# Altium schematic sheet SmartHelmet.SchDoc
size 610 x 355 mm; SheetNumber: 1; SheetTotal: 1
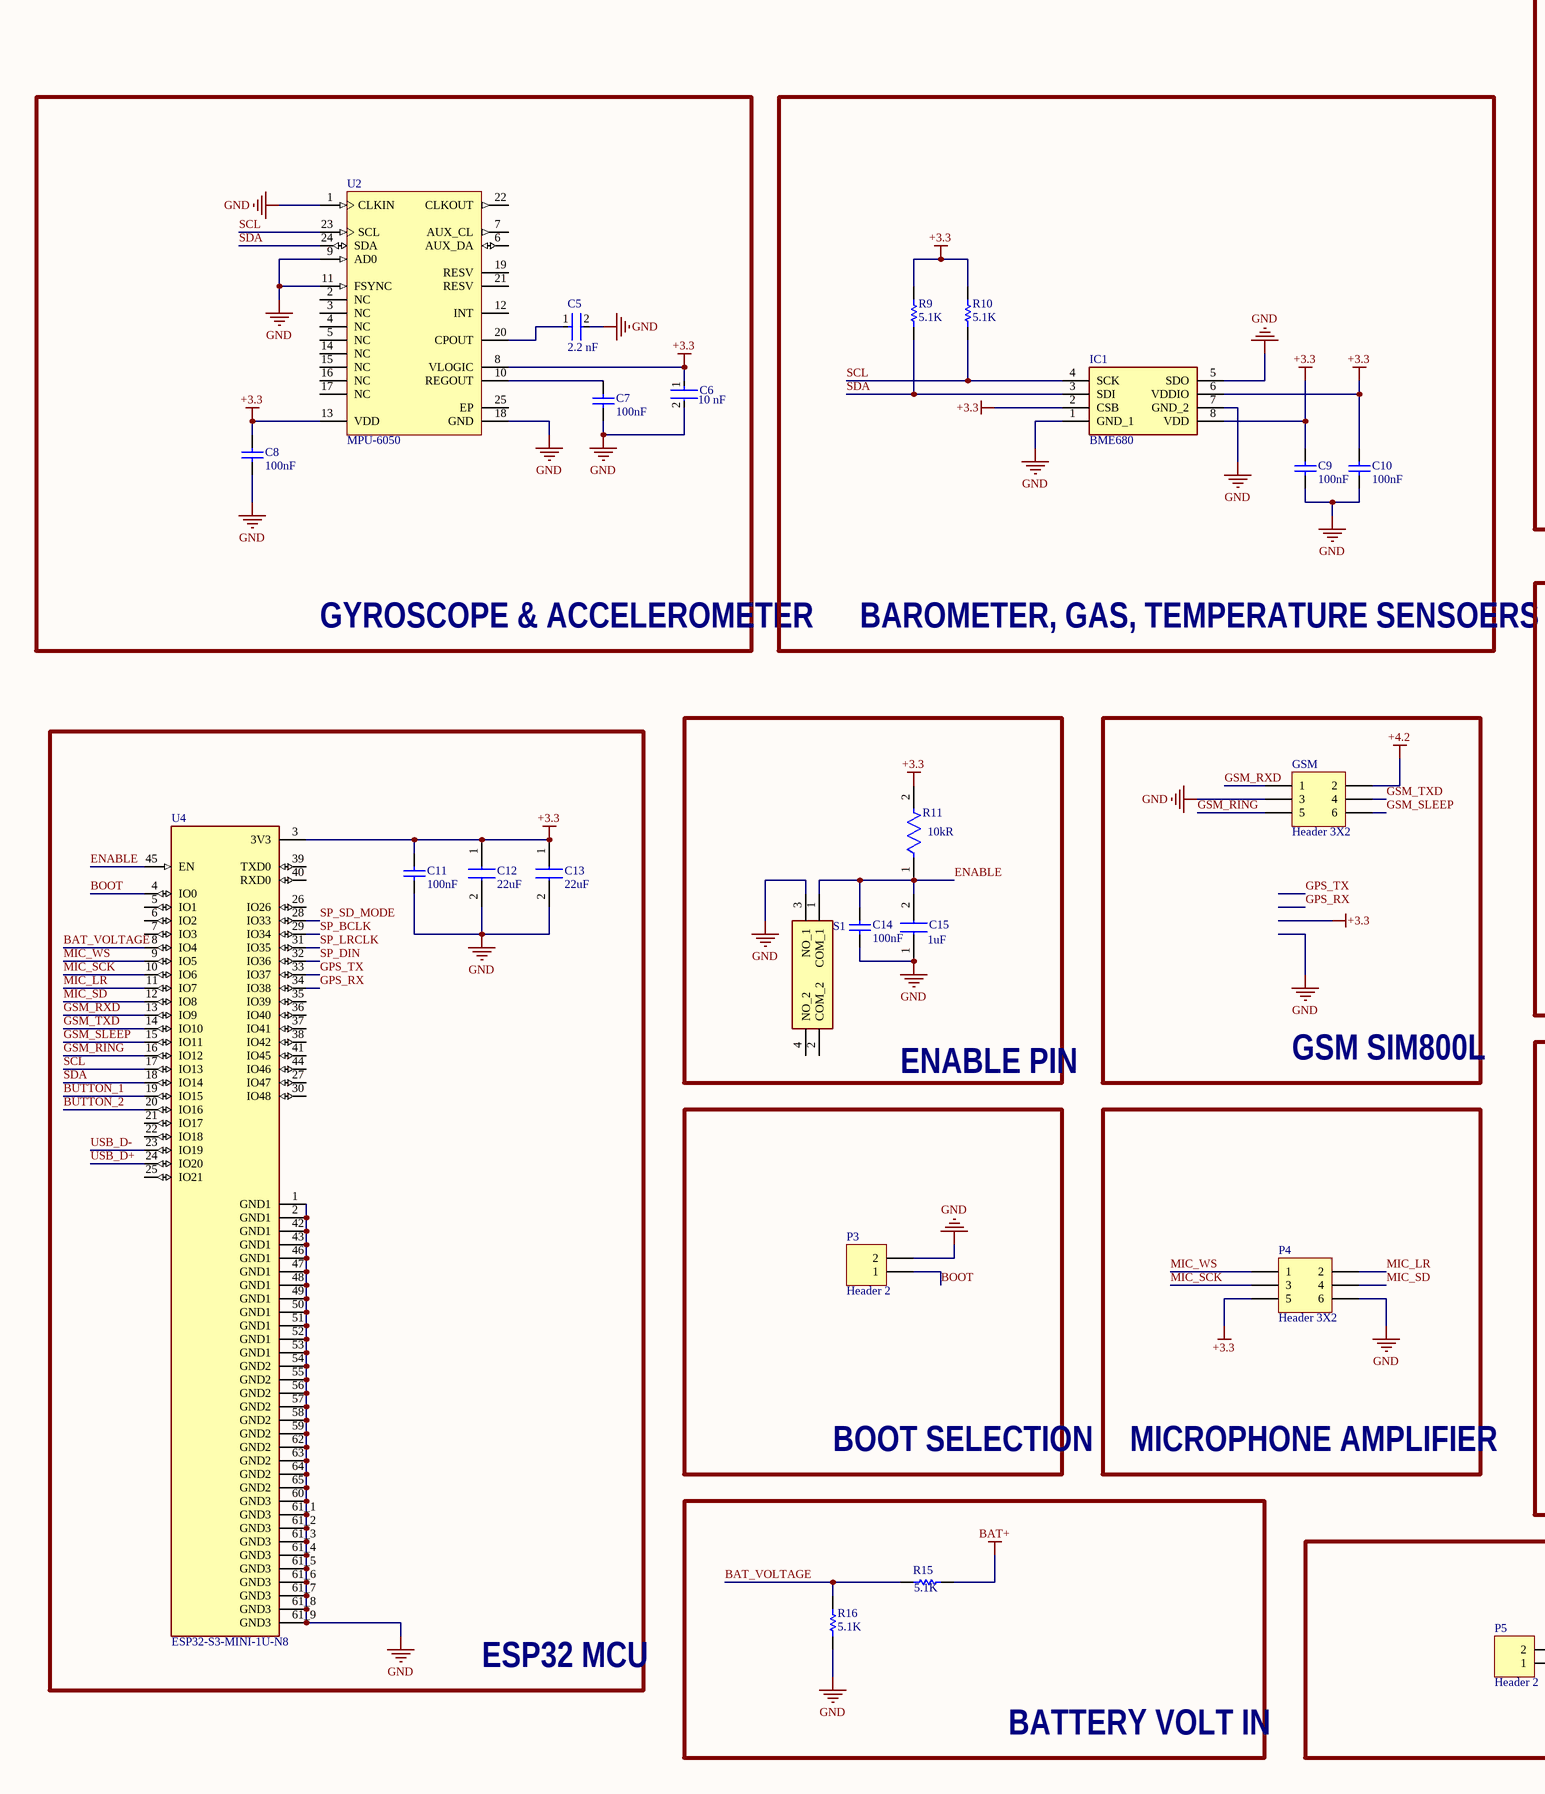
[diagram p0: SmartHelmet.SchDoc, left]
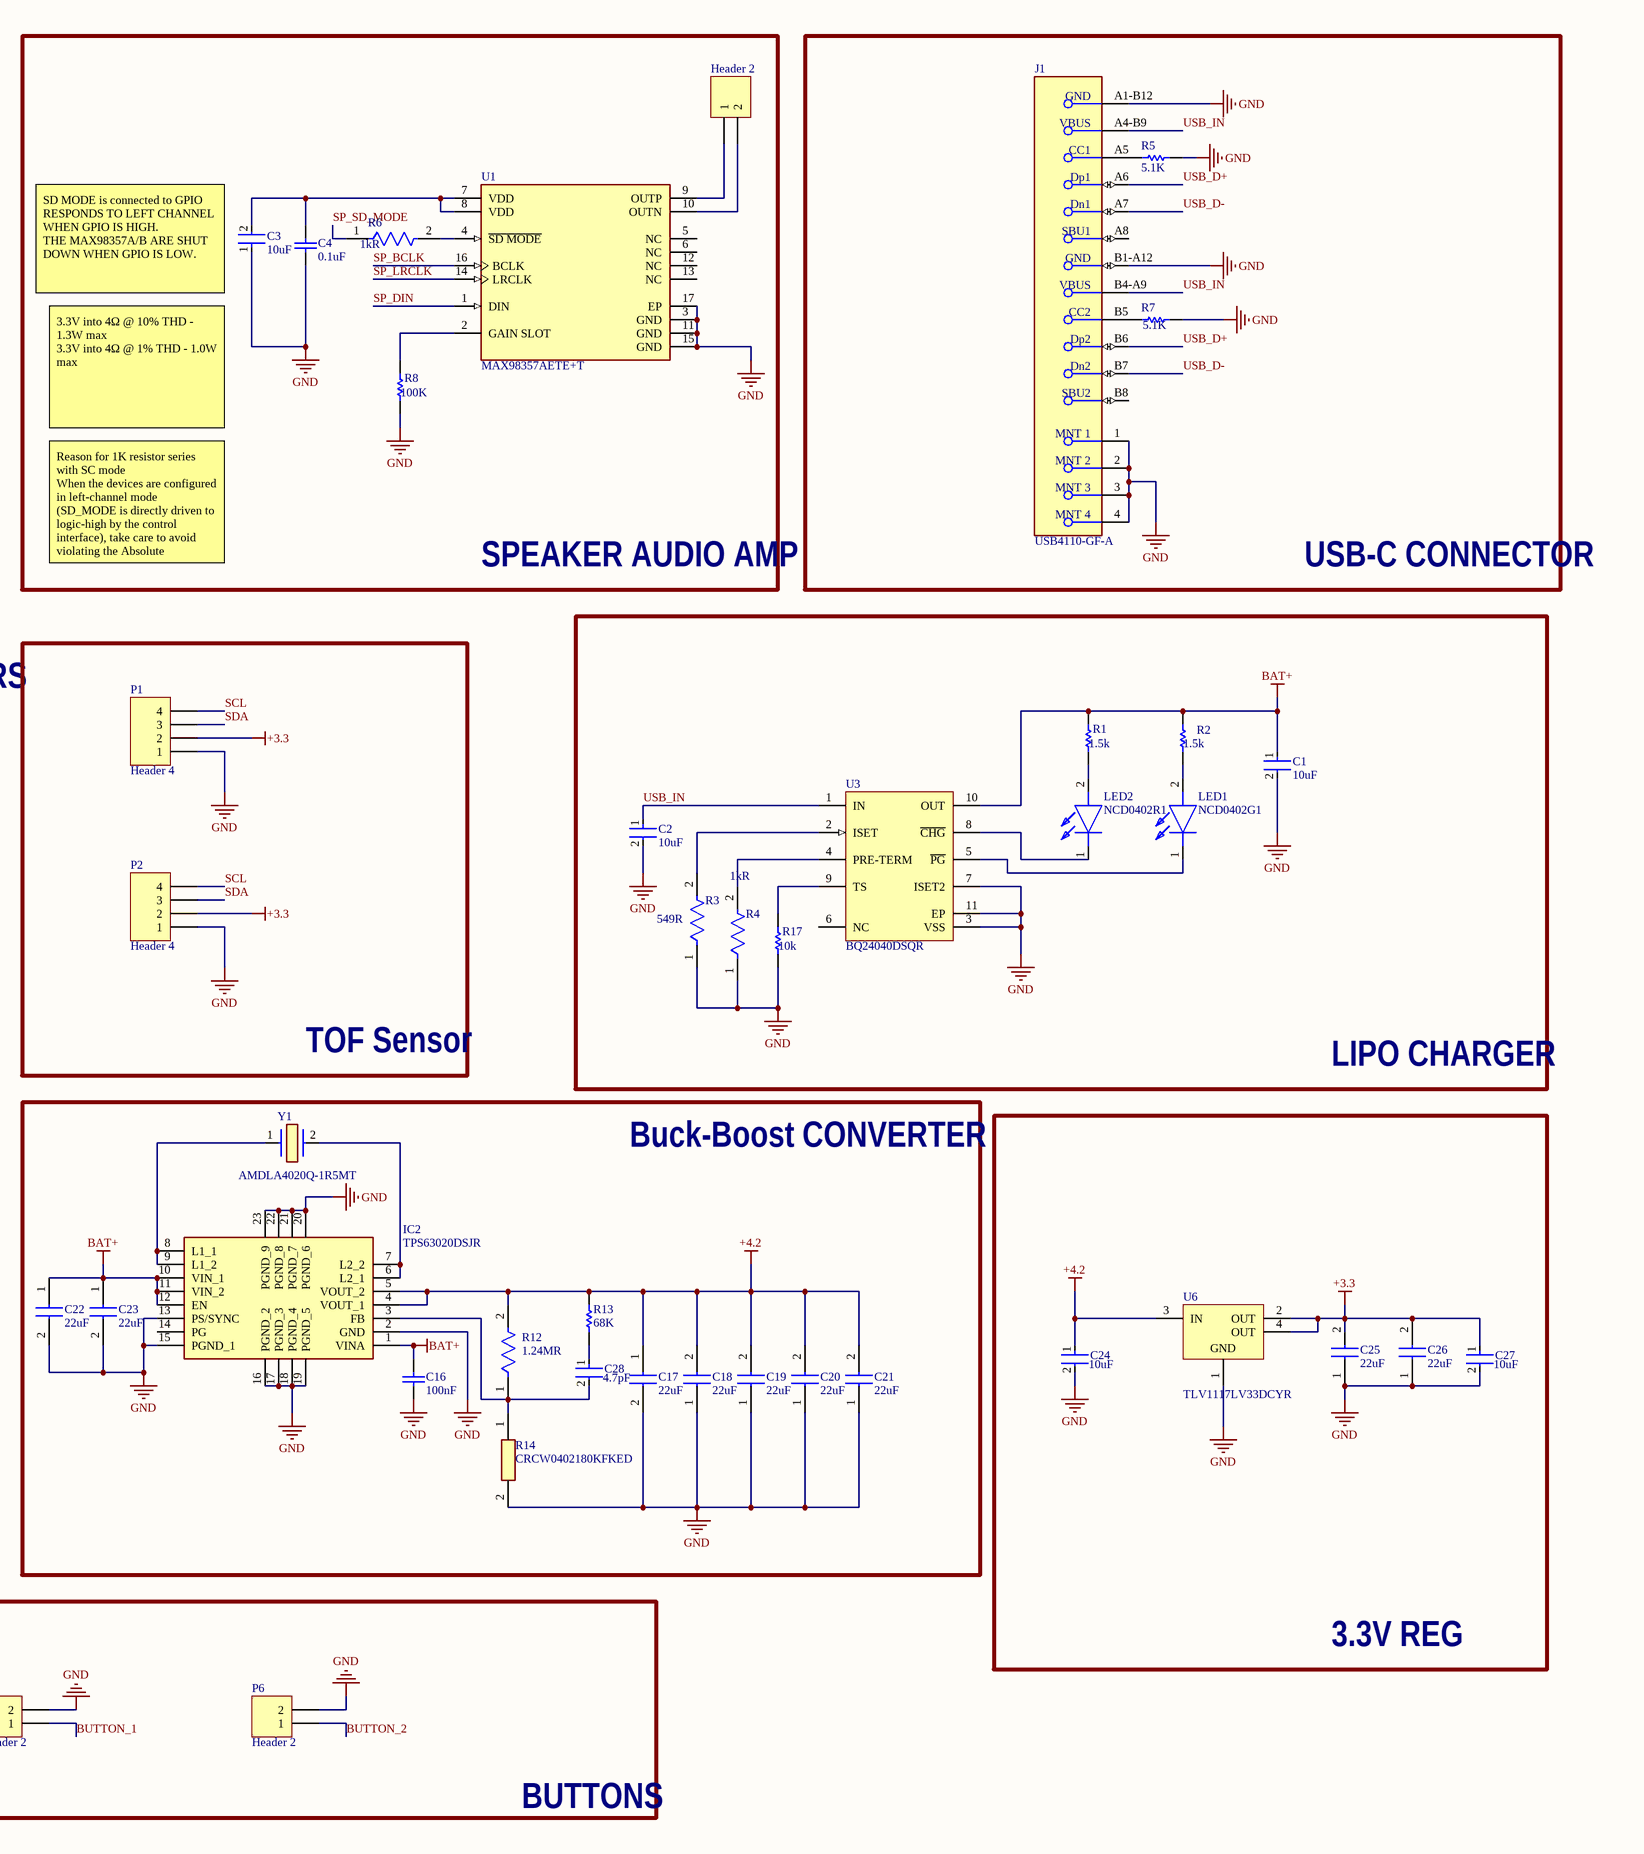
[diagram p1: SmartHelmet.SchDoc, right]

## Parts
C1  Capacitance: 10uF  [FP-CL05A106MP5NUNC-MFG]  (hidden comment: CL05A106MP5NUNC)
C2  Capacitance: 10uF  [FP-CL05A106MP5NUNC-MFG]  (hidden comment: CL05A106MP5NUNC)
C3  Capacitance: 10uF  [FP-CL05A106MP5NUNC-MFG]  (hidden comment: CL05A106MP5NUNC)
C4  Capacitance: 0.1uF  [CAPC1050X55X23ML05T13]  (hidden comment: CL05B104KO5NNNC)
C5  Capacitance: 2.2 nF  [FP-CC0402-MFG]  (hidden comment: CC0402KRX7R9BB222)
C6  Capacitance: 10 nF  [FP-CC0402-MFG]  (hidden comment: CC0402KRX7R9BB103)
C7  Capacitance: 100nF  [CAPC1050X55X23ML05T13]  (hidden comment: CL05B104KO5NNNC)
C8  Capacitance: 100nF  [CAPC1050X55X23ML05T13]  (hidden comment: CL05B104KO5NNNC)
C9  Capacitance: 100nF  [CAPC1050X55X23ML05T13]  (hidden comment: CL05B104KO5NNNC)
C10  Capacitance: 100nF  [CAPC1050X55X23ML05T13]  (hidden comment: CL05B104KO5NNNC)
C11  Capacitance: 100nF  [CAPC1050X55X23ML05T13]  (hidden comment: CL05B104KO5NNNC)
C12  value 22uF  [CAPC1608X105N]  (hidden comment: CL10A226MP8NUNE)
C13  value 22uF  [CAPC1608X105N]  (hidden comment: CL10A226MP8NUNE)
C14  Capacitance: 100nF  [CAPC1050X55X23ML05T13]  (hidden comment: CL05B104KO5NNNC)
C15  Capacitance: 1uF  [CAPC1005X55N]  (hidden comment: GRM155C71C105KE11J)
C16  Capacitance: 100nF  [CAPC1050X55X23ML05T13]  (hidden comment: CL05B104KO5NNNC)
C17  value 22uF  [CAPC1608X105N]  (hidden comment: CL10A226MP8NUNE)
C18  value 22uF  [CAPC1608X105N]  (hidden comment: CL10A226MP8NUNE)
C19  value 22uF  [CAPC1608X105N]  (hidden comment: CL10A226MP8NUNE)
C20  value 22uF  [CAPC1608X105N]  (hidden comment: CL10A226MP8NUNE)
C21  value 22uF  [CAPC1608X105N]  (hidden comment: CL10A226MP8NUNE)
C22  value 22uF  [CAPC1608X105N]  (hidden comment: CL10A226MP8NUNE)
C23  value 22uF  [CAPC1608X105N]  (hidden comment: CL10A226MP8NUNE)
C24  Capacitance: 10uF  [FP-CL05A106MP5NUNC-MFG]  (hidden comment: CL05A106MP5NUNC)
C25  value 22uF  [CAPC1608X105N]  (hidden comment: CL10A226MP8NUNE)
C26  value 22uF  [CAPC1608X105N]  (hidden comment: CL10A226MP8NUNE)
C27  Capacitance: 10uF  [FP-CL05A106MP5NUNC-MFG]  (hidden comment: CL05A106MP5NUNC)
C28  Capacitance: 4.7pF  [FP-GCQ155-0_05-IPC_B]  (hidden comment: GCQ1555C1H4R7BB01D)
GSM  Header 3X2  [HDR2X3]
IC1  BME680  [BME680]
IC2  TPS63020DSJR  [TPS63020DSJR]
J1  USB4110-GF-A  [FP-USB4110-GF-A-MFG]
LED1  NCD0402G1  [NCD0402R1]
LED2  NCD0402R1  [NCD0402R1]
P1  Header 4  [HDR1X4]
P2  Header 4  [HDR1X4]
P3  Header 2  [HDR1X2]
P4  Header 3X2  [HDR2X3]
P5  Header 2  [HDR1X2]
P6  Header 2  [HDR1X2]
P7  Header 2  [HDR1X2]
R1  value 1.5k  [RESC1005X40X25ML05T10]  (hidden comment: RC0402FR-071K5L)
R2  value 1.5k  [RESC1005X40X25ML05T10]  (hidden comment: RC0402FR-071K5L)
R3  Resistance: 549R  [FP-AC0402-IPC_B]  (hidden comment: AC0402FR-07549RL)
R4  Resistance: 1kR  [FP-RC0402-0_4-IPC_A]  (hidden comment: RC0402FR-071KL)
R5  Resistance: 5.1K  [RESC1005X40X25ML10T10]  (hidden comment: RK73H1ETTP5101F)
R6  Resistance: 1kR  [FP-CRCW0402-e3-MFG]  (hidden comment: CRCW04021K00FKED)
R7  Resistance: 5.1K  [RESC1005X40X25ML10T10]  (hidden comment: RK73H1ETTP5101F)
R8  resistance: 100K  [RESC1005X40X25NL05T10]  (hidden comment: RC0402FR-07100KL)
R9  Resistance: 5.1K  [RESC1005X40X25ML10T10]  (hidden comment: RK73H1ETTP5101F)
R10  Resistance: 5.1K  [RESC1005X40X25ML10T10]  (hidden comment: RK73H1ETTP5101F)
R11  Resistance: 10kR  [FP-CRCW0402-e3-IPC_C]  (hidden comment: CRCW040210K0FKEE)
R12  Resistance: 1.24MR  [FP-CRCW0402-e3-IPC_C]  (hidden comment: CRCW04021M24FKED)
R13  Resistance: 68K  [RESC1005X40X25LL05T05]  (hidden comment: CRCW040268K0FKED)
R14  CRCW0402180KFKED  [RESC1005X40N]
R15  Resistance: 5.1K  [RESC1005X40X25ML10T10]  (hidden comment: RK73H1ETTP5101F)
R16  Resistance: 5.1K  [RESC1005X40X25ML10T10]  (hidden comment: RK73H1ETTP5101F)
R17  value 10k  [RESC1005X40X25ML05T10]  (hidden comment: RC0402FR-0710KL)
S1  PTS526_SK15_SMTR2_LFS  [PTS526SK15SMTR2LFS]  (value not drawn)
U1  MAX98357AETE+T  [FP-T1633-4-MFG]
U2  MPU-6050  [IS-QFN-24_V]
U3  BQ24040DSQR  [DSQ0010A_V]
U4  ESP32-S3-MINI-1U-N8  [XCVR_ESP32-S3-MINI-1U-N8]
U6  TLV1117LV33DCYR  [DCY0004A_N]
Y1  AMDLA4020Q-1R5MT  [INDPM4440X200N]

## Blocks framed on the sheet
SPEAKER AUDIO AMP: C3 C4 P7 R6 R8 U1
USB-C CONNECTOR: J1 R5 R7
GYROSCOPE & ACCELEROMETER: C5-C8 U2
BAROMETER, GAS, TEMPERATURE SENSOERS: C9 C10 IC1 R9 R10
TOF Sensor: P1 P2
LIPO CHARGER: C1 C2 LED1 LED2 R1-R4 R17 U3
ESP32 MCU: C11-C13 U4
ENABLE PIN: C14 C15 R11 S1
GSM SIM800L: GSM
Buck-Boost CONVERTER: C16-C23 C28 IC2 R12-R14 Y1
3.3V REG: C24-C27 U6
BOOT SELECTION: P3
MICROPHONE AMPLIFIER: P4
BATTERY VOLT IN: R15 R16
BUTTONS: P5 P6

## Nets
+3.3: C6.1 C8.2 C9.1 C10.1 C11.2 C12.1 C13.1 C25.2 C26.2 C27.1 IC1.2(CSB) IC1.6(VDDIO) IC1.8(VDD) P1.2 P2.2 P4.5 R9.2 R10.2 R11.2 U2.8(VLOGIC) U2.13(VDD) U4.3(3V3) U6.2(OUT) U6.4(OUT)
+4.2: C17.1 C18.2 C19.2 C20.2 C21.2 C24.1 GSM.2 IC2.4(VOUT_1) IC2.5(VOUT_2) R12.2 R13.2 U6.3(IN)
BAT+: C1.1 C16.2 C22.1 C23.1 IC2.1(VINA) IC2.10(VIN_1) IC2.11(VIN_2) IC2.12(EN) R1.2 R2.2 R15.2 U3.10(OUT)
GND: C1.2 C2.2 C3.1 C4.1 C5.2 C6.2 C7.1 C8.1 C9.2 C10.2 C11.1 C12.2 C13.2 C14.2 C15.1 C16.1 C17.2 C18.1 C19.1 C20.1 C21.1 C22.2 C23.2 C24.2 C25.1 C26.1 C27.2 GSM.3 IC1.1(GND_1) IC1.5(SDO) IC1.7(GND_2) IC2.2(GND) IC2.13(PS/SYNC) IC2.15(PGND_1) IC2.16(PGND_2) IC2.17(PGND_3) IC2.18(PGND_4) IC2.19(PGND_5) IC2.20(PGND_6) IC2.21(PGND_7) IC2.22(PGND_8) IC2.23(PGND_9) J1.1(MNT_1) J1.2(MNT_2) J1.3(MNT_3) J1.4(MNT_4) J1.A1-B12(GND) J1.B1-A12(GND) P1.1 P2.1 P3.2 P4.6 P5.2 P6.2 R3.1 R4.1 R5.1 R7.2 R8.1 R14.2 R16.1 R17.1 S1.3(NO_1) U1.3(GND) U1.11(GND) U1.15(GND) U1.17(EP) U2.1(CLKIN) U2.9(AD0) U2.11(FSYNC) U2.18(GND) U3.3(VSS) U3.7(ISET2) U3.11(EP) U4.1(GND1) U4.2(GND1) U4.42(GND1) U4.43(GND1) U4.46(GND1) U4.47(GND1) U4.48(GND1) U4.49(GND1) U4.50(GND1) U4.51(GND1) U4.52(GND1) U4.53(GND1) U4.54(GND2) U4.55(GND2) U4.56(GND2) U4.57(GND2) U4.58(GND2) U4.59(GND2) U4.60(GND3) U4.61_1(GND3) U4.61_2(GND3) U4.61_3(GND3) U4.61_4(GND3) U4.61_5(GND3) U4.61_6(GND3) U4.61_7(GND3) U4.61_8(GND3) U4.61_9(GND3) U4.62(GND2) U4.63(GND2) U4.64(GND2) U4.65(GND2) U6.1(GND)
BAT_VOLTAGE: R15.1 R16.2 U4.8(IO4)
BOOT: P3.1 U4.4(IO0)
BUTTON_1: P5.1 U4.19(IO15)
BUTTON_2: P6.1 U4.20(IO16)
ENABLE: C14.1 C15.2 R11.1 S1.1(COM_1) U4.45(EN)
GPS_RX: U4.34(IO38)
GPS_TX: U4.33(IO37)
GSM_RING: GSM.5 U4.16(IO12)
GSM_RXD: GSM.1 U4.13(IO9)
GSM_SLEEP: GSM.6 U4.15(IO11)
GSM_TXD: GSM.4 U4.14(IO10)
MIC_LR: P4.2 U4.11(IO7)
MIC_SCK: P4.3 U4.10(IO6)
MIC_SD: P4.4 U4.12(IO8)
MIC_WS: P4.1 U4.9(IO5)
SCL: IC1.4(SCK) P1.4 P2.4 R10.1 U2.23(SCL) U4.17(IO13)
SDA: IC1.3(SDI) P1.3 P2.3 R9.1 U2.24(SDA) U4.18(IO14)
SP_BCLK: U1.16(BCLK) U4.29(IO34)
SP_DIN: U1.1(DIN) U4.32(IO36)
SP_LRCLK: U1.14(LRCLK) U4.31(IO35)
SP_SD_MODE: R6.1 U4.28(IO33)
USB_D+: J1.A6(Dp1) J1.B6(Dp2) U4.24(IO20)
USB_D-: J1.A7(Dn1) J1.B7(Dn2) U4.23(IO19)
USB_IN: C2.1 J1.A4-B9(VBUS) J1.B4-A9(VBUS) U3.1(IN)
NetC3_2: C3.2 C4.2 U1.7(VDD) U1.8(VDD)
NetC5_1: C5.1 U2.20(CPOUT)
NetC7_2: C7.2 U2.10(REGOUT)
NetC28_1: C28.1 R13.1
NetC28_2: C28.2 IC2.3(FB) R12.1 R14.1
NetIC2_6: IC2.6(L2_1) IC2.7(L2_2) Y1.2
NetIC2_8: IC2.8(L1_1) IC2.9(L1_2) Y1.1
NetJ1_A5: J1.A5(CC1) R5.2
NetJ1_B5: J1.B5(CC2) R7.1
NetLED1_1: LED1.1(K) U3.5(~{PG})
NetLED1_2: LED1.2(A) R2.1
NetLED2_1: LED2.1(K) U3.8(~{CHG})
NetLED2_2: LED2.2(A) R1.1
NetP7_1: P7.1 U1.9(OUTP)
NetP7_2: P7.2 U1.10(OUTN)
NetR3_2: R3.2 U3.2(ISET)
NetR4_2: R4.2 U3.4(PRE-TERM)
NetR6_2: R6.2 U1.4(~{SD_MODE})
NetR8_2: R8.2 U1.2(GAIN_SLOT)
NetR17_2: R17.2 U3.9(TS)

Not connected (* = marked no-connect by the designer): IC2 14(PG); J1 A8(SBU1) B8(SBU2); S1 2(COM_2) 4(NO_2); U1 5(NC) 6(NC) 12(NC) 13(NC); U2 2(NC) 3(NC) 4(NC) 5(NC) 6(AUX_DA) 7(AUX_CL) 12(INT) 14(NC) 15(NC) 16(NC) 17(NC) 19(RESV) 21(RESV) 22(CLKOUT) 25(EP); U3 6(NC); U4 5(IO1) 6(IO2) 7(IO3) 21(IO17) 22(IO18) 25(IO21) 26(IO26) 27(IO47) 30(IO48) 35(IO39) 36(IO40) 37(IO41) 38(IO42) 39(TXD0) 40(RXD0) 41(IO45) 44(IO46)

## Notes on the sheet
- (near C3) SD MODE is connected to GPIO
  RESPONDS TO LEFT CHANNEL WHEN GPIO IS HIGH.
  THE MAX98357A/B ARE SHUT DOWN WHEN GPIO IS LOW.
- 3.3V into 4Ω @ 10% THD - 1.3W max
  3.3V into 4Ω @ 1% THD - 1.0W max
- Reason for 1K resistor series with SC mode
  When the devices are configured in left-channel mode
  (SD_MODE is directly driven to logic-high by the control interface), take care to avoid violating the Absolute
  Maximum Ratings limits for SD_MODE. Ensuring that
  VDD is always greater than VDDIO is one way to prevent
  SD_MODE from violating the Absolute Maximum Ratings
  limits. If this is not possible in the application (e.g., if VDD
  < 3.0V and VDDIO = 3.3V), then it is necessary to add a
  small resistance (2kΩ) in series with SD_MODE to limit
  the current into the SD_MODE pin. This is not a concern
  when using the right channel or (left/2 + right/2) modes.

## Library data of the parts
C1-C3 C24 C27 = CMP-13271-000002-1: CAP CER 10UF 10V X5R 0402; Manufacturer: Samsung; Temperature Coefficient: 15%; Tolerance: 20%; Material: Ceramic; Octopart: https://octopart.com/cl05a106mp5nunc-samsung-22457395; Voltage Rating: 10V; RoHS: TRUE; Value: 10uF; Height: 0.7mm; Digikey Description: CAP CER 10UF 10V X5R 0402; Automotive: No; Package: CL05A106MP5NUNC; Device Class L1: Passive Components; Temperature Range High: +85°C; ComponentLink2Description: Datasheet; Device Class L2: Capacitors; Temperature Characteristic: X5R; Manufacturer Part Number: CL05A106MP5NUNC; Temperature: -55°C to +85°C; ComponentLink2URL: http://www.samsungsem.com/kr/support/product-search/mlcc/__icsFiles/afieldfile/2019/05/10/19-CL05A106MP5NUNC.pdf; Device Class L3: Ceramic Capacitors; Category: Cap; Temperature Range Low: -55°C; Ipc Land Pattern Name: CAPC10050X50; Lead Free: Yes
C4 C7-C11 C14 C16 = CMP-2000-05439-1: Chip Capacitor, 100 nF, +/- 10%, 16 V, -55 to 125 degC, 0402 (1005 Metric), RoHS, Tape and Reel; Manufacturer: Samsung Electro-Mechanics; Dielectric: X7R; Rated Voltage: 16V; Case Size/Dimension: 0402; Tolerance (%): ±10%; Manufacturer URL: http://www.samsungsem.com/global/index.jsp; Datasheet URL: https://datasheet.ciiva.com/29198/458718-da-01-en-vs-kondensator-0402-29198423.pdf; Datasheet Version: Nov-10
C5 = CMP-1034-01742-2: CAP CER 2200PF 50V X7R 0402; Manufacturer: YAGEO; Material: Ceramic; Automotive Grade: NA; Temperature Coefficient: 30ppm/°C; Tolerance: 0.1; Value: 2.2 nF; Footprint Url: http://www.yageo.com/exep/pages/download/literatures/UPY-C_GEN_24.pdf; Temperature: -55°C to +125°C; RoHS: TRUE; Mouser Description: Multilayer Ceramic Capacitors MLCC - SMD/SMT 2.2nF 50V X7R 10%; Temperature Range Low: -55°C; ComponentLink2URL: http://www.yageo.com/documents/recent/UPY-GP_NP0_16V-to-50V_16.pdf; Digikey Description: CAP CER 2200PF 50V X7R 0402; Manufacturer Part Number: CC0402KRX7R9BB222; Device Class L3: Ceramic Capacitors; Lead Free: Yes; Octopart: https://octopart.com/cc0402krx7r9bb222-yageo-39467642; Package: CC0402; ComponentLink2Description: Datasheet; Category: Cap; Device Class L1: Passive Components; Height: 0.55mm; Temperature Characteristic: X7R; Device Class L2: Capacitors; Voltage Rating: 50 V; Ipc Land Pattern Name: CAPC10050X50; Temperature Range High: +125°C; Automotive: No
C6 = CMP-2100-03592-2: CAP CER 10000PF 50V X7R 0402; Manufacturer: YAGEO; Temperature Coefficient: 30ppm/°C; Material: Ceramic; Automotive Grade: NA; Tolerance: 0.1; Value: 10 nF; Device Class L3: Ceramic Capacitors; Temperature: -55°C to +125°C; Footprint Url: http://www.yageo.com/exep/pages/download/literatures/UPY-C_GEN_24.pdf; Ipc Land Pattern Name: CAPC10050X50; Device Class L1: Passive Components; Automotive: No; Octopart: https://octopart.com/cc0402krx7r9bb103-yageo-8376513; Manufacturer Part Number: CC0402KRX7R9BB103; Lead Free: Yes; Temperature Range Low: -55°C; Height: 0.55mm; ComponentLink2URL: http://www.yageo.com/documents/recent/UPY-GP_NP0_16V-to-50V_16.pdf; Category: Cap; ComponentLink2Description: Datasheet; Temperature Range High: +125°C; Digikey Description: CAP CER 10000PF 50V X7R 0402; Voltage Rating: 50 V; Package: CC0402; Device Class L2: Capacitors; Mouser Description: 0402 10 nF 50 V ±10 % Tolerance X7R SMT Multilayer Ceramic Capacitor; RoHS: TRUE; Temperature Characteristic: X7R
C12 C13 C17-C23 C25 C26 = CL10A226MP8NUNE: Capacitor; Manufacturer_Name: SAMSUNG; Datasheet Link: https://datasheet.datasheetarchive.com/originals/distributors/Datasheets-DGA10/2407063.pdf; Height: 1.05mm; Manufacturer_Part_Number: CL10A226MP8NUNE; Mouser Part Number: 187-CL10A226MP8NUNE; Mouser Price/Stock: https://www.mouser.co.uk/ProductDetail/Samsung-Electro-Mechanics/CL10A226MP8NUNE?qs=gRKWieUq2Hb5O0PTfRKzDQ%3D%3D; Arrow Part Number: CL10A226MP8NUNE; Arrow Price/Stock: https://www.arrow.com/en/products/cl10a226mp8nune/samsung-electro-mechanics?region=nac
  C12 C13 C17-C22 C25 C26: Supplier 1: Mouser; Supplier Part Number 1: 187-CL10A226MP8NUNE
C15 = GRM155C71C105KE11J: Capacitor; Manufacturer_Name: Murata Electronics; Datasheet Link: http://www.murata.com/~/media/webrenewal/support/library/catalog/products/capacitor/mlcc/c02e.pdf; Height: 0.55mm; Manufacturer_Part_Number: GRM155C71C105KE11J; Mouser Part Number: 81-GRM155C71C105KE11; Mouser Price/Stock: https://www.mouser.co.uk/ProductDetail/Murata-Electronics/GRM155C71C105KE11J?qs=pUKx8fyJudDfEc2RwhPUhw%3D%3D; Supplier 1: Mouser; Supplier Part Number 1: 81-GRM155C71C105KE11
C28 = CMP-06035-040661-1: High Q Ceramic Capacitor for Automotive 4.7pF ±0.1pF 50VDC C0G 0402 Paper T/R; Voltage Rating: 50V; Case/Package: 0402; Mount: Surface Mount; Packaging: Tape and Reel; Ratings: AEC-Q200; Min Operating Temperature: -55°C; Max Operating Temperature: 125°C
GSM P4 = Header 3X2: Header, 3-Pin, Dual row; LatestRevisionDate: 17-Jul-2002; LatestRevisionNote: Re-released for DXP Platform.; Publisher: Altium Limited
IC1 = BME680: Integrated Circuit; Manufacturer_Name: BOSCH; Datasheet Link: https://www.bosch-sensortec.com/media/boschsensortec/downloads/datasheets/bst-bme680-ds001.pdf; Height: 1mm; Manufacturer_Part_Number: BME680; Mouser Part Number: 262-BME680; Mouser Price/Stock: https://www.mouser.co.uk/ProductDetail/Bosch-Sensortec/BME680?qs=v271MhAjFHjo0yA%2FC4OnDQ%3D%3D; Arrow Part Number: BME680; Arrow Price/Stock: https://www.arrow.com/en/products/bme680/bosch?region=europe; Supplier 1: Mouser; Supplier Part Number 1: 262-BME680
IC2 = TPS63020DSJR: Integrated Circuit; Manufacturer_Name: Texas Instruments; Datasheet Link: https://www.ti.com/lit/ds/symlink/tps63020.pdf?HQS=dis-dk-null-digikeymode-dsf-pf-null-wwe&ts=1623612296427; Height: 1mm; Manufacturer_Part_Number: TPS63020DSJR; Mouser Part Number: 595-TPS63020DSJR; Mouser Price/Stock: https://www.mouser.co.uk/ProductDetail/Texas-Instruments/TPS63020DSJR?qs=C44r%252BX3hXgL3LjjgiOMWew%3D%3D; Arrow Part Number: TPS63020DSJR; Arrow Price/Stock: https://www.arrow.com/en/products/tps63020dsjr/texas-instruments?region=nac; Supplier 1: Mouser; Supplier Part Number 1: 595-TPS63020DSJR
J1 = CMP-245163-000002-1: CONN USB 2.0 TYPE-C R/A SMT; Manufacturer: GCT; Conn Orientation: Right Angle; Usb Standard: USB 2.0; Voltage Rating: 20V; Current Rating: 3/4.25/1.25/0.25A; Number Of Contacts: 16; Is Female: yes; Shielding: true; Standoff Height: 0.1mm; Octopart: https://octopart.com/usb4110-gf-a-gct-103941985; Temperature: -40°C to +85°C; RoHS: TRUE; Automotive: No; Contact Material: Gold,Nickel; Device Class L1: Connectors; Device Class L2: USB Connectors; Package: 0; Lead Free: Yes; ComponentLink2URL: https://gct.co/files/drawings/usb4110.pdf; Temperature Range High: +85°C; Temperature Range Low: -40°C; Height: 3.46mm; Manufacturer Part Number: USB4110-GF-A; ComponentLink2Description: Datasheet; Device Class L3: unset; Digikey Description: CONN USB 2.0 TYPE-C R/A SMT; Category: Conn
LED1 = NCD0402R1: LED  NCD0402G1; Manufacturer_Name: Foshan NationStar Optoelectronics; Datasheet Link: https://datasheet.lcsc.com/lcsc/2008201033_Foshan-NationStar-Optoelectronics-NCD0402R1_C130719.pdf; Height: 0.45mm; Manufacturer_Part_Number: NCD0402R1
LED2 = NCD0402R1: LED; Manufacturer_Name: Foshan NationStar Optoelectronics; Datasheet Link: https://datasheet.lcsc.com/lcsc/2008201033_Foshan-NationStar-Optoelectronics-NCD0402R1_C130719.pdf; Height: 0.45mm; Manufacturer_Part_Number: NCD0402R1
P1 P2 = Header 4: Header, 4-Pin; LatestRevisionDate: 17-Jul-2002; LatestRevisionNote: Re-released for DXP Platform.; Publisher: Altium Limited
P3 P5-P7 = Header 2: Header, 2-Pin; LatestRevisionDate: 17-Jul-2002; LatestRevisionNote: Re-released for DXP Platform.; Publisher: Altium Limited
R1 R2 = CMP-2002-07464-1: Manufacturer: Yageo / Phycomp; Part Number: RC0402FR-071K5L
R3 = CMP-03412-030313-2: RES 549Ω ±1% 0.063W 0402; Temperature Coefficient: 100ppm/°C; Max Power Dissipation: 63mW; Min Operating Temperature: -55°C; Number of Terminations: 2; Height: 0.015inch; Series: AC; Width: 0.02inch; Packaging: Tape and Reel; RoHS Compliant: Yes; Resistor Type: Thick Film; Features: Moisture Resistant; Tolerance: 1%; Max Operating Temperature: 155°C; Case/Package: 0402; Length: 0.039inch
R4 = CMP-2002-07472-3: RES 1K OHM 1% 1/16W 0402; Max Power Dissipation: 63mW; Voltage Rating (DC): 50V; Temperature Coefficient: 100ppm/°C; Power Rating: 62.5mW; Technology: THICK FILM; Size Code: 0402; Series: RC; Length: 1mm; Case/Package: 0402; Features: Moisture Resistant; Termination: SMD/SMT; Case Code (Metric): 1005; Reach SVHC Compliant: Yes; Number of Terminations: 2; Tolerance: 1%; Lead Free: Lead Free; Military Standard: Not; Resistor Type: Thick Film; Max Operating Temperature: 155°C; RoHS Compliant: Yes; Construction: Rectangular; Voltage Rating: 50V; Packaging: Tape and Reel; Height: 0.32mm; Number of Pins: 2; Resistance Tolerance: 1%; Case Code (Imperial): 0402; Depth: 0.5mm; Min Operating Temperature: -55°C; Width: 0.5mm
R5 R7 R9 R10 R15 R16 = CMP-2002-04046-1: Manufacturer: KOA Speer; Part Number: RK73H1ETTP5101F
R6 = CMP-2002-08276-2: RES Thick Film, 1kΩ, 1%, 0.063W, 100ppm/°C, 0402; Power Rating: 63mW; Voltage Rating (DC): 50V; Package Quantity: 10; Termination: SMD/SMT; Width: 0.5mm; Military Standard: Not; Length: 1mm; Contact Plating: Tin; Mount: Surface Mount; Packaging: Tape and Reel; Case Code (Imperial): 0402; Tolerance: 1%; Weight: 2.3E-05oz; Number of Pins: 2; Case/Package: 0402; Case Code (Metric): 1005; Lead Free: Lead Free; Number of Terminations: 2; Max Power Dissipation: 63mW; Depth: 0.5mm; Temperature Coefficient: 100ppm/°C; Max Operating Temperature: 155°C; Height: 0.35mm; Features: Automotive AEC-Q200; Composition: Thick Film; Radiation Hardening: No; Voltage Rating: 50V; Min Operating Temperature: -55°C
R8 = CMP-2002-07343-1: Manufacturer: Yageo / Phycomp; Part Number: RC0402FR-07100KL
R11 = CMP-1011-00623-2: RES Thick Film, 10kΩ, 1%, 0.063W, 100ppm/°C, 0402; Max Power Dissipation: 63mW; Case Code (Metric): 1005; Length: 0.039inch; Min Operating Temperature: -55°C; Number of Terminations: 2; Tolerance: 1%; Military Standard: Not; Max Operating Temperature: 155°C; Temperature Coefficient: 100ppm/°C; Features: Automotive AEC-Q200; Composition: Thick Film; Case/Package: 0402; Contact Plating: Tin; Depth: 0.5mm; Case Code (Imperial): 0402; Lead Free: Lead Free; Height: 0.016inch; Radiation Hardening: No; Width: 0.02inch; Packaging: Tape and Reel
R12 = CMP-2002-00298-2: RES Thick Film, 1.24MΩ, 1%, 0.063W, 100ppm/°C, 0402; Max Power Dissipation: 63mW; Voltage Rating (DC): 50V; Termination: SMD/SMT; Depth: 0.5mm; Package Quantity: 10; Height: 0.016inch; Military Standard: Not; Contact Plating: Tin; Length: 1mm; Temperature Coefficient: 100ppm/°C; Composition: Thick Film; Tolerance: 1%; Weight: 2.3E-05oz; Case/Package: 0402; Radiation Hardening: No; Case Code (Metric): 1005; Case Code (Imperial): 0402; Features: Automotive AEC-Q200; Power Rating: 63mW; Max Operating Temperature: 155°C; Number of Pins: 2; Number of Terminations: 2; Width: 0.02inch; Voltage Rating: 50V; Min Operating Temperature: -55°C; Packaging: Tape and Reel; Lead Free: Lead Free
R13 = CMP-2002-00170-1: Manufacturer: Vishay Dale; Part Number: CRCW040268K0FKED
R14 = CRCW0402180KFKED: Resistor; Manufacturer_Name: Vishay; Datasheet Link: http://www.vishay.com/docs/20035/dcrcwe3.pdf; Height: 0.4mm; Manufacturer_Part_Number: CRCW0402180KFKED; Mouser Part Number: 71-CRCW0402180KFKED; Mouser Price/Stock: https://www.mouser.co.uk/ProductDetail/Vishay-Dale/CRCW0402180KFKED?qs=QPqDnsKvzKeCvZvZQylUHg%3D%3D; Arrow Part Number: CRCW0402180KFKED; Arrow Price/Stock: https://www.arrow.com/en/products/crcw0402180kfked/vishay; Supplier 1: Mouser; Supplier Part Number 1: 71-CRCW0402180KFKED
R17 = CMP-2002-07353-1: Manufacturer: Yageo / Phycomp; Part Number: RC0402FR-0710KL
S1 = PTS526_SK15_SMTR2_LFS: Switch; Manufacturer_Name: C & K COMPONENTS; Manufacturer_Part_Number: PTS526 SK15 SMTR2 LFS; Datasheet Link: https://www.ckswitches.com/media/2780/pts526.pdf; Height: 1.65mm; Mouser Part Number: 611-PTS526SK15SMR2L; Mouser Price/Stock: https://www.mouser.co.uk/ProductDetail/CK/PTS526-SK15-SMTR2-LFS?qs=UXgszm6BlbF5Ezp94JAQtw%3D%3D; Arrow Part Number: PTS526 SK15 SMTR2 LFS; Arrow Price/Stock: https://www.arrow.com/en/products/pts526-sk15-smtr2-lfs/ck?region=nac; Supplier 1: Mouser; Supplier Part Number 1: 611-PTS526SK15SMR2L
U1 = CMP-05698-000018-1: IC AMP CLASS D MONO 3.2W 16TQFN; Max Supply Voltage: 5.5V; Max Output Current: 1.6A; Voltage Gain: 15dB; Max Power Dissipation: 1.666W; Min Supply Voltage: 2.5V; Power Supply Rejection Ratio (PSRR): 77dB; Series: -; Contact Plating: Tin; Min Operating Temperature: -40°C; Packaging: Tape and Reel; Max Output Power: 3.2W; Mount: Surface Mount; Number of Pins: 16; RoHS Compliant: Yes; Max Operating Temperature: 85°C; Radiation Hardening: No
U2 = CMP-1753-00002-2: 3-Axis Gyroscope, Accelerometer and a Digital Motion Processor(TM) (DMP), 2.375 to 3.46 V, -40 to 85 degC, 24-Pin QFN, RoHS, Tape and Reel; Manufacturer: InvenSense; Featured Product: MPU-60506-Axis,IntegratedI²CSolution; Other Names: 1428-1007-2 / MPU6050; Sensor Type: MotionTracking; Online Catalog: MPU-6000™Series; Unit PriceUSD: Digital; Datasheet Version: Rev. 3.3, 05/2012; Category: Sensors,Transducers; Datasheet URL: http://datasheet.octopart.com/MPU-6050-InvenSense-datasheet-14421344.pdf; Family: Multifunction; Standard Package: 5,000; Manufacturer URL: http://www.invensense.com/; Output Type: Digital; Dynamic Catalog: MPU-6000™Series
U3 = CMP-0321-00456-2: 800 mA, Single-Input, Single Cell Li-Ion Battery Charger with Auto Start. Vovp=6.6 V, 3.5 V, -40 to 85 degC, 10-pin SON (DSQ), Green (RoHS & no Sb/Br); Manufacturer: Texas Instruments; NiCd: N; Vin(Min)(V): 3.5; SubFamily: Battery Charge Management; PackageDescription: 10-Pin Plastic Small Outline No-Lead, 2 x 2 x 0.8 mm Body, 0.4 mm Pitch, Exposed Pad; PackageVersion: revB, Apr-2010; Mounting Technology: Surface Mount; Eco-Plan: Green (RoHS & no Sb/Br); ComponentLink1URL: http://www.ti.com/general/docs/lit/getliterature.tsp?genericPartNumber=BQ24040&fileType=pdf; PartNumber: BQ24040DSQR; DatasheetVersion: SLUS941A; Over Voltage Protection: N; PackageReference: DSQ0010A; NiMH: N; Li-Ion: N; Lead Acid: N; Li-Polymer: N; ComponentLink1Description: Datasheet
U4 = ESP32-S3-MINI-1U-N8: Bluetooth, WiFi 802.11b/g/n, Bluetooth v5.0 Transceiver Module 2.4GHz Antenna Not Included, U.FL Surface Mount; MF: Espressif Systems; SnapEDA_Link: https://www.snapeda.com/parts/ESP32-S3-MINI-1U-N8/Espressif+Systems/view-part/?ref=snap; Package: VFQFN-56 Espressif Systems; Value: *; MP: ESP32-S3-MINI-1U-N8; Check_prices: https://www.snapeda.com/parts/ESP32-S3-MINI-1U-N8/Espressif+Systems/view-part/?ref=eda; Supplier 1: Mouser; Supplier Part Number 1: 356-ESP32S3MINI1UN8
U6 = CMP-0395-00503-2: Single Output LDO, 1 A, Fixed 3.3 V Output, 2 to 5.5 V Input, 4-pin SOT-223 (DCY), -40 to 125 degC, Green (RoHS & no Sb/Br); Manufacturer: Texas Instruments; Vout Adj(Min)(V): 3.3; Vdo(Typ)(mV): 1200; Iq(Typ)(mA): 0.05; Accuracy(%): 2; Iout(Max)(A): 1; SubFamily: Single Channel LDO; Vin(Max)(V): 5.5; PackageReference: DCY0004A; PackageDescription: 4-Pin Plastic Small Outline, Body 3.5 x 6.5 mm, Pitch 2.3 mm; Vout Adj(Max)(V): 3.3; Mounting Technology: Surface Mount; ComponentLink2Description: Datasheet; ComponentLink1Description: Manufacturer URL; PartNumber: TLV1117LV33DCYR; ComponentLink3Description: Package Specification; ComponentLink1URL: http://www.ti.com/; ComponentLink2URL: http://www.ti.com/general/docs/lit/getliterature.tsp?genericPartNumber=TLV1117LV33&fileType=pdf; Fixed Output Options(V): 3.3; PackageVersion: 4202506/B; Vin(Min)(V): 2; DatasheetVersion: SBVS160A; Eco-Plan: Green (RoHS & no Sb/Br); ComponentLink3URL: http://www.ti.com/litv/pdf/mpds094a; Code_JEDEC: TO-261
Y1 = AMDLA4020Q-1R5MT: Crystal or Oscillator; Manufacturer_Name: ABRACON; Datasheet Link: https://abracon.com/datasheets/AMDLA4020Q.pdf; Height: 2mm; Manufacturer_Part_Number: AMDLA4020Q-1R5MT; Mouser Part Number: 815-AMDLA4020Q-1R5MT; Mouser Price/Stock: https://www.mouser.co.uk/ProductDetail/ABRACON/AMDLA4020Q-1R5MT?qs=7MVldsJ5Uax4YduHzChsEg%3D%3D; Supplier 1: Mouser; Supplier Part Number 1: 815-AMDLA4020Q-1R5MT